# EAGLE design detection_input (EAGLE 7.6.0)
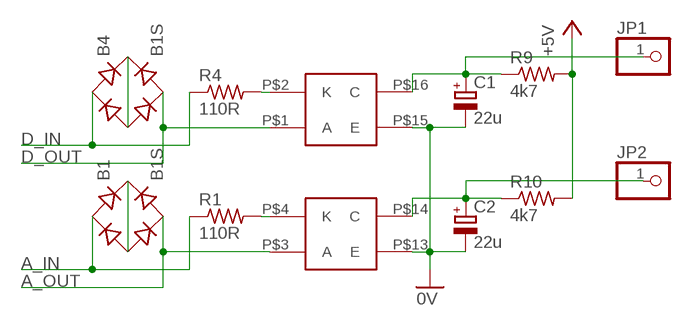
[diagram p0: schematic, sheet 1]

## Parts
B1  B1S  [MBS]
B4  B1S  [MBS]
C1  22u  CPOL-EUE2-4  [E2-4]
C2  22u  CPOL-EUE2-4  [E2-4]
JP1  PINHD-1X1  [1X01]
JP2  PINHD-1X1  [1X01]
R1  110R  R-US_R0805  [R0805]
R4  110R  R-US_R0805  [R0805]
R9  4k7  R-US_R0805  [R0805]
R10  4k7  R-US_R0805  [R0805]
U$1  ILQ620D  [ILQ620D]

## Nets
0V: C1.- C2.- U$1.P$13(E) U$1.P$15(E)
+5V: R9.2 R10.2
A: C1.+ JP1.1 R9.1 U$1.P$16(C)
A_IN: B1.AC1 R1.1
A_OUT: B1.AC2 U$1.P$3(A)
B: C2.+ JP2.1 R10.1 U$1.P$14(C)
D_IN: B4.AC1 R4.1
D_OUT: B4.AC2 U$1.P$1(A)
N$4: B1.+ B1.-
N$6: R1.2 U$1.P$4(K)
N$7: R4.2 U$1.P$2(K)
N$8: B4.+ B4.-

## Library data of the parts
B1 B4 = rectifier:B*S: Surface Mount Glass Passivated Bridge Rectifiers Source: Comchip Bridge Rectifiers B05S-G_B10S-G.pdf
C1 C2 = resistor:CPOL-EU: POLARIZED CAPACITOR, European symbol
JP1 JP2 = pinhead:PINHD-1X1: PIN HEADER
R1 R4 R9 R10 = resistor:R-US_: RESISTOR, American symbol
U$1 = Custom:ILQ620D

## Board
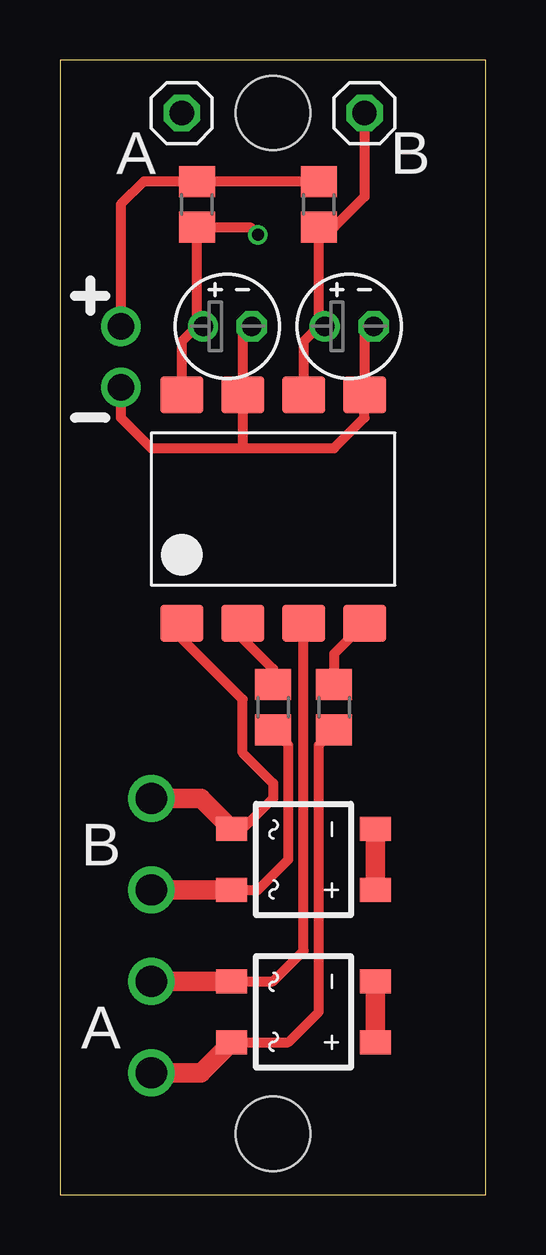
[diagram p1: board, top side]
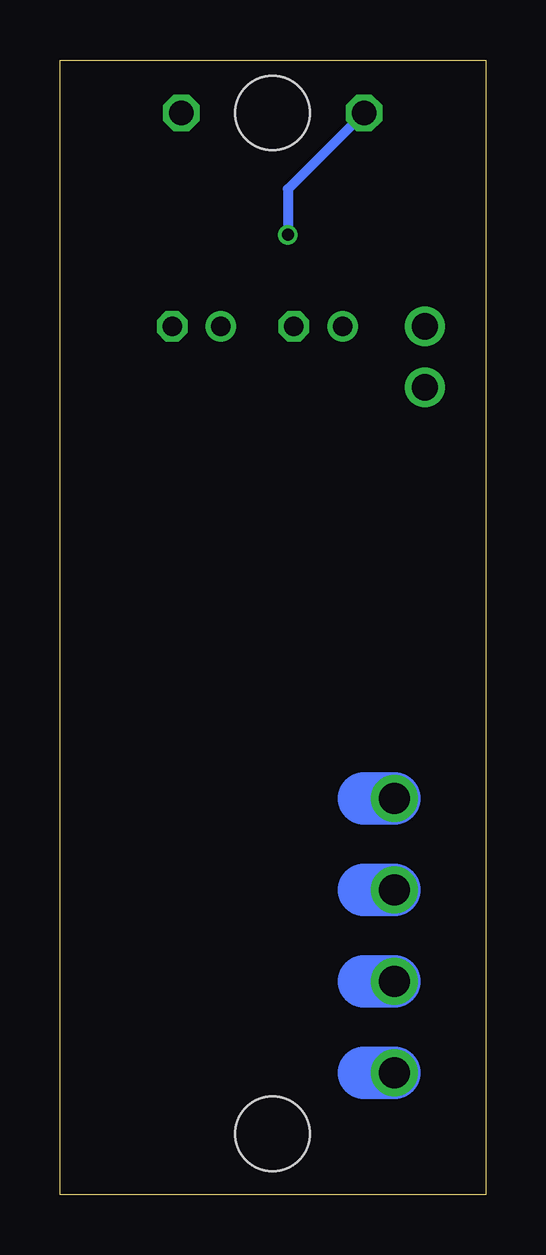
[diagram p2: board, bottom side, seen from below]

Size 17.76 x 47.3 mm. Coordinates in mm from the lower left corner, seen from the top.
Outline: 0,0 17.76,0 17.76,47.3 0,47.3 0,0
Copper layers (1*16): Top 0.035mm / dielectric 1.6mm / Bottom 0.035mm
Design rules "Elecrow_2-layer_PCB_eagle_rule": minimum track width 6mil, minimum drill 12mil, track to track 6mil, track to pad 6mil, pad to pad 6mil, via to via 8mil, smd to smd 0mil, copper to edge 20mil, drill to drill 10mil, minimum pad ring 6mil, minimum via ring 6mil, stop-mask expansion 0mil, vias tented up to drill 100mil, thermal gap 10mil
Holes 3.1 mm at 8.89,2.54 8.89,45.09

### Footprints (pad centres in the part's own frame; a part is rotated, then mirrored left to right if it is on the bottom)
MBS = smd 1 x 1.3: + -1.27,-3; - 1.27,-3; AC1 -1.27,3; AC2 1.27,3
E2-4 = drill 0.813 pad 1.27: + -1.016,0 | drill 0.813 pad 1.27 octagon: - 1.016,0
1X01 = drill 1.016 octagon: 1 0,0
R0805 = smd 1.3 x 1.5: 1 -0.95,0; 2 0.95,0
ILQ620D = smd 1.52 x 1.78: P$1 -4.76,7.62; P$2 -4.76,5.08; P$3 -4.76,2.54; P$4 -4.76,0; P$13 4.76,0; P$14 4.76,2.54; P$15 4.76,5.08; P$16 4.76,7.62

### Placement (x,y rotation side)
B1  10.16,7.62 90 top
B4  10.16,13.97 90 top
C1  6.99,36.2 0 top
C2  12.06,36.2 0 top
JP1  5.08,45.09 0 top
JP2  12.7,45.09 0 top
R1  11.43,20.32 90 top
R4  8.89,20.32 90 top
R9  5.71,41.27 90 top
R10  10.79,41.27 90 top
U$1  12.7,28.57 90 top

### Tracks (layer width: path | path; a pad name or v marks a point on that pad's centre or on a via)
0V  (via drill 1.1)
  Top 0.406: v2.54,33.66 2.54,32.38 3.81,31.12 7.62,31.12 | 7.62,31.12 11.43,31.12 12.7,32.38 U$1.P$13 12.7,35.81 C2.- | 7.62,31.12 U$1.P$15 7.62,35.81 C1.-
+5V  (via drill 1.1)
  Top 0.406: v2.54,36.2 2.54,41.27 3.49,42.23 R9.2 R10.2
A  (via drill 0.5)
  Top 0.406: 5.71,36.2 R9.1 7.93,40.32 v8.26,40 | C1.+ 5.71,36.2 | 5.71,36.2 5.08,35.56 U$1.P$16
  Bottom 0.406: JP1.1 8.26,41.91 v8.26,40
A_IN  (via drill 1.3)
  Top 0.406: B1.AC1 9.53,6.35 10.79,7.62 10.79,18.73 R1.1
  Top 0.813: B1.AC1 5.89,5.08 v3.81,5.08
  Bottom 2.184: v3.81,5.08 5.08,5.08
A_OUT  (via drill 1.3)
  Top 0.406: B1.AC2 8.89,8.89 10.16,10.16 U$1.P$3
  Top 0.813: B1.AC2 v3.81,8.89
  Bottom 2.184: v3.81,8.89 5.08,8.89
B
  Top 0.406: 10.79,36.2 R10.1 11.43,40.32 12.7,41.59 JP2.1 | C2.+ 10.79,36.2 | 10.79,36.2 10.16,35.56 U$1.P$14
D_IN  (via drill 1.3)
  Top 0.406: B4.AC1 8.26,12.7 9.53,13.97 9.53,18.73 R4.1
  Top 0.813: B4.AC1 v3.81,12.7
  Bottom 2.184: v3.81,12.7 5.08,12.7
D_OUT  (via drill 1.3)
  Top 0.406: B4.AC2 7.62,15.24 8.89,16.51 8.89,17.14 7.62,18.41 7.62,20.64 5.08,23.18 U$1.P$1
  Top 0.813: B4.AC2 5.89,16.51 v3.81,16.51
  Bottom 2.184: v3.81,16.51 5.08,16.51
N$4
  Top 0.813: B1.+ B1.-
N$6
  Top 0.406: U$1.P$4 11.43,22.54 R1.2
N$7
  Top 0.406: R4.2 8.89,21.91 7.62,23.18 U$1.P$2
N$8
  Top 0.813: B4.+ B4.-

### Text on the board
tNames: A | B | B | A